# EAGLE schematic Electronic_Schematic_(Draft)_v5 (EAGLE 9.7.0)
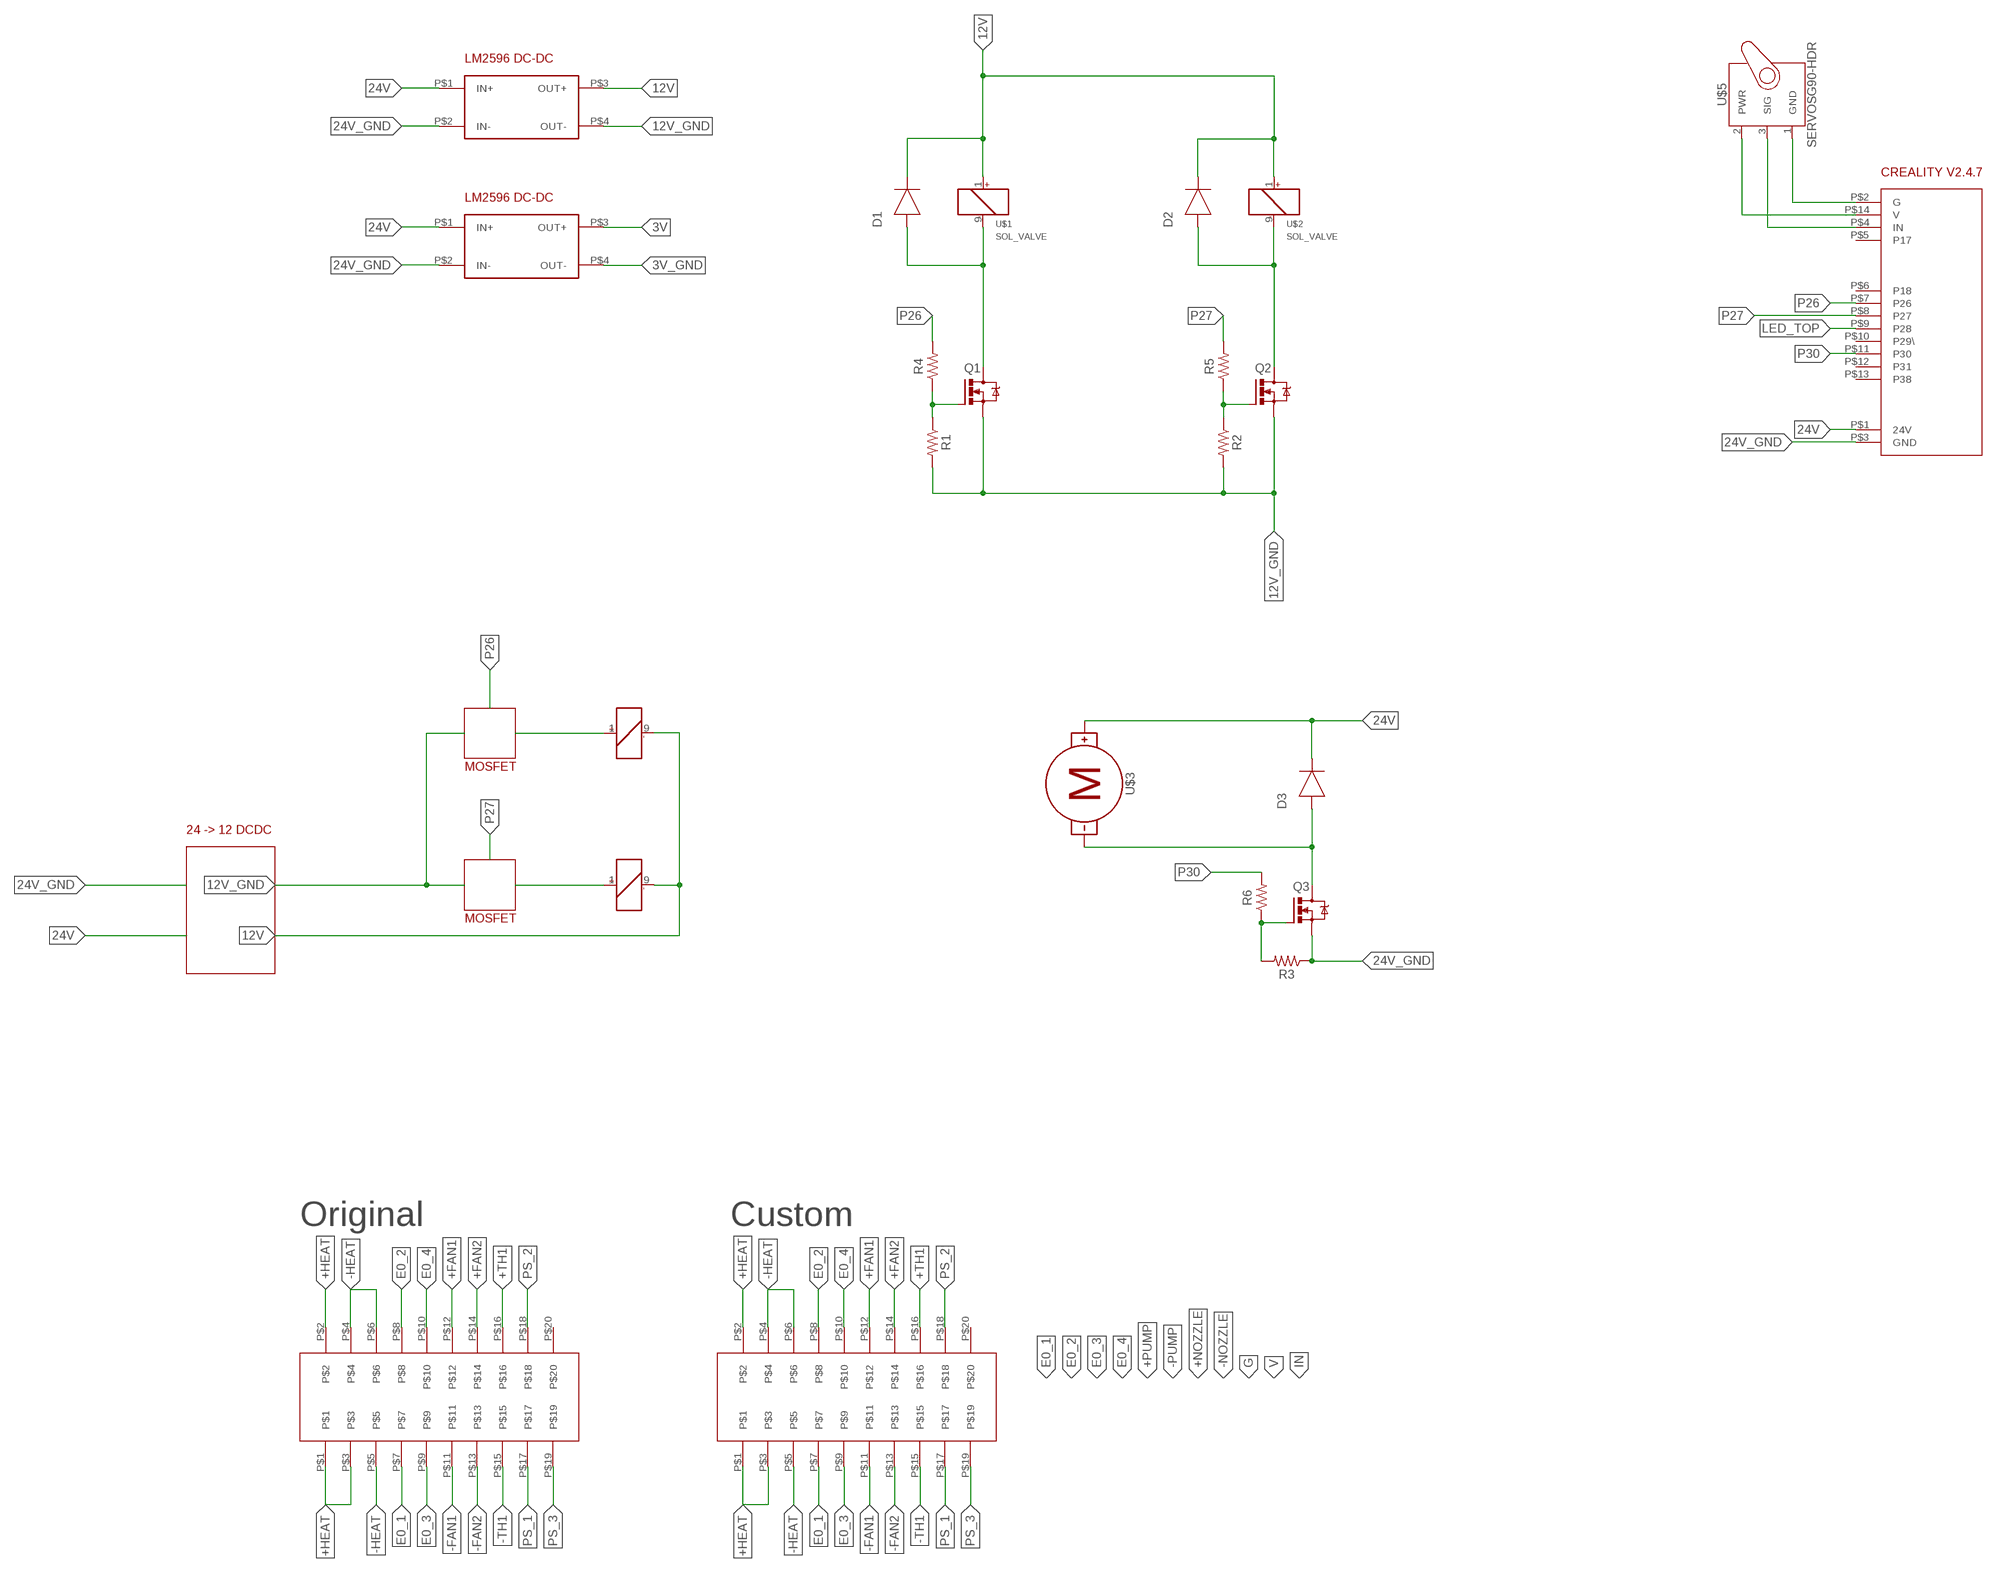
[diagram p0: schematic, sheet 1]

## Parts
D1  DIODE  (no package)
D2  DIODE  (no package)
D3  DIODE  (no package)
Q1  NMOSFET  NMOSFETSOT23-GSD  [SOT23]
Q2  NMOSFET  NMOSFETSOT23-GSD  [SOT23]
Q3  NMOSFET  NMOSFETSOT23-GSD  [SOT23]
R1  R-US_CHIP-0402(1005-METRIC)  [RESC1005X40]
R2  R-US_CHIP-0402(1005-METRIC)  [RESC1005X40]
R3  R-US_CHIP-0402(1005-METRIC)  [RESC1005X40]
R4  R-US_CHIP-0402(1005-METRIC)  [RESC1005X40]
R5  R-US_CHIP-0402(1005-METRIC)  [RESC1005X40]
R6  R-US_CHIP-0402(1005-METRIC)  [RESC1005X40]
U$1  SOL_VALVE  [TO5-8-TH-NOGND]
U$2  SOL_VALVE  [TO5-8-TH-NOGND]
U$3  MOTOR_DG01D  [DG01D]
U$4  CREALITY_V2.4.7  [CREALITY_V2.4.7]
U$5  SERVOSG90-HDR  [1X03]
U$6  LM2595_DC-DC  [LM2596_DC-DC]
U$7  SOL_VALVE  [TO5-8-TH-NOGND]
U$8  SOL_VALVE  [TO5-8-TH-NOGND]
U$9  HEAD_CONNECTOR  [HEAD_CONNECTOR]
U$10  HEAD_CONNECTOR  [HEAD_CONNECTOR]
U$11  LM2595_DC-DC  [LM2596_DC-DC]

## Nets
3V: U$11.P$3(OUT+)
3V_GND: U$11.P$4(OUT-)
12V: D1.C D2.C U$1.1(C+) U$2.1(C+) U$6.P$3(OUT+) U$7.9(C-) U$8.9(C-)
12V_GND: Q1.2(S) Q2.2(S) R1.2 R2.2 U$6.P$4(OUT-)
24V: D3.C U$3.+ U$4.P$1(24V) U$6.P$1(IN+) U$11.P$1(IN+)
24V_GND: Q3.2(S) R3.1 U$4.P$3(GND) U$6.P$2(IN-) U$11.P$2(IN-)
+FAN1: U$9.P$12 U$10.P$12
+FAN2: U$9.P$14 U$10.P$14
+HEAT: U$9.P$1 U$9.P$2 U$9.P$3 U$10.P$1 U$10.P$2 U$10.P$3
+TH1: U$9.P$16 U$10.P$16
-FAN1: U$9.P$11 U$10.P$11
-FAN2: U$9.P$13 U$10.P$13
-HEAT: U$9.P$4 U$9.P$5 U$9.P$6 U$10.P$4 U$10.P$5 U$10.P$6
-TH1: U$9.P$15 U$10.P$15
E0_1: U$9.P$7 U$10.P$7
E0_2: U$9.P$8 U$10.P$8
E0_3: U$9.P$9 U$10.P$9
E0_4: U$9.P$10 U$10.P$10
LED_TOP: U$4.P$9(P28)
N$1: Q1.1(G) R1.1 R4.1
N$2: D1.A Q1.3(D) U$1.9(C-)
N$3: D2.A Q2.3(D) U$2.9(C-)
N$4: D3.A Q3.3(D) U$3.-
N$5: Q2.1(G) R2.1 R5.1
N$6: U$4.P$2(G) U$5.1(GND)
N$7: U$4.P$4(IN) U$5.3(SIG)
N$8: U$4.P$14(V) U$5.2(PWR)
N$9: Q3.1(G) R3.2 R6.1
N$10: U$8.1(C+)
N$11: U$7.1(C+)
P26: R4.2 U$4.P$7(P26)
P27: R5.2 U$4.P$8(P27)
P30: R6.2 U$4.P$11(P30)
PS_1: U$9.P$17 U$10.P$17
PS_2: U$9.P$18 U$10.P$18
PS_3: U$9.P$19 U$10.P$19
Unconnected: U$4.P$5(P17) U$4.P$6(P18) U$4.P$10(P29\) U$4.P$12(P31) U$4.P$13(P38) U$9.P$20 U$10.P$20

## Notes on the sheet
- MOSFET
- 24 -> 12 DCDC
- MOSFET
- Original
- Custom

## Library data of the parts
D1-D3 = ngspice-simulation:DIODE: Diode
Q1-Q3 = Transistor:NMOSFET: N-Channel MOSFET - Generic; CATEGORY: Transistor; SUB-CATEGORY: MOSFET; TYPE: N-Channel
R1-R6 = Resistor:R-US: Resistor Fixed - ANSI; CATEGORY: Resistors; DESCRIPTION: Chip Resistor 1.05 X 0.54 X 0.40 mm body 0402(1005-METRIC) Package; PACKAGE_SIZE: 0402; PACKAGE_TYPE: SMD
U$1 U$2 U$7 U$8 = PNP:SOL_VALVE: Check availability <https://pricing.snapeda.com/parts/412/Adafruit/view-part?ref=eda>; AVAILABILITY: Not in stock; CHECK_PRICES: https://www.snapeda.com/parts/412/Adafruit+Industries/view-part/?ref=eda; DESCRIPTION: 12-VDC solenoid with a stroke length of 5.5 mm, 40-Ω coil resistance, and a maximum starting force of 5 N.; MF: Adafruit; MP: 412; PACKAGE: None; PRICE: None; SNAPEDA_LINK: https://www.snapeda.com/parts/412/Adafruit+Industries/view-part/?ref=snap
U$3 = Tinkercad:MOTOR
U$4 = PNP:CREALITY_V2.4.7
U$5 = Tinkercad:SERVO
U$6 U$11 = PNP:LM2595_DC-DC
U$9 U$10 = PNP:HEAD_CONNECTOR